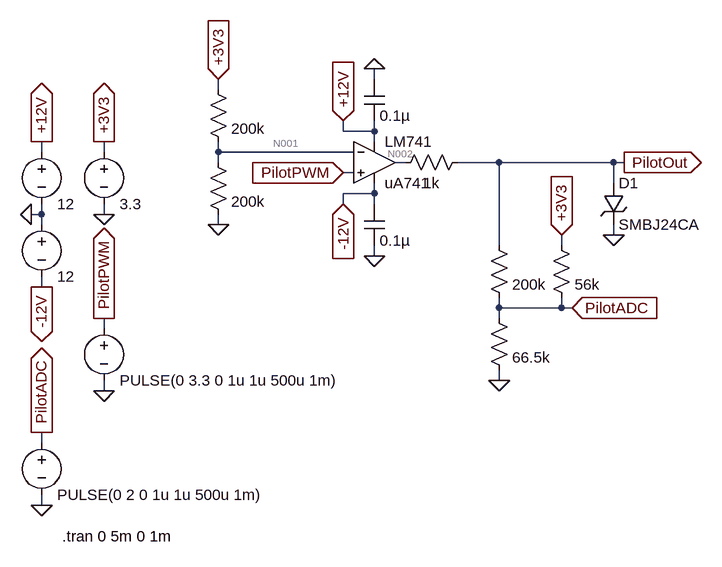
[diagram p0: schematic control_pilot.asc]
* control_pilot.asc
V1 +12V 0 12
V2 0 -12V 12
V3 +3V3 0 3.3
V4 PilotPWM 0 PULSE(0 3.3 0 1u 1u 500u 1m)
R1 +3V3 N001 200k
R2 N001 0 200k
C1 0 +12V 0.1µ V=25
C2 -12V 0 0.1µ V=25
R3 PilotOut N002 1k
R4 +3V3 PilotADC 56k
R5 PilotOut PilotADC 200k
R7 PilotADC 0 66.5k
D1 PilotOut 0 SMBJ24CA
V5 PilotADC 0 PULSE(0 2 0 1u 1u 500u 1m)
* LM741: uA741 (symbol AutoGenerated\uA741 not available, pins judged from their places): In+=PilotPWM In-=N001 V+=+12V V-=-12V OUT=N002
.model D D
.lib standard.dio
.tran 0 5m 0 1m
.backanno
.end

* Results of the author's LTspice run, read from the files saved beside the schematic
* Operating Point, zero values left out:
*   V(+12v) = 12 V
*   V(-12v) = -12 V
*   V(+3v3) = 3.3 V
*   V(n001) = 1.634 V
*   V(pilotout) = -11.76 V
*   V(n002) = -11.82 V
*   I(D1) = -235.1 nA
*   I(R1) = 8.33 µA
*   I(R2) = 8.17 µA
*   I(R3) = 59.02 µA
*   I(R4) = 58.93 µA
*   I(R5) = -58.79 µA
*   I(V1) = -1.337 mA
*   I(V2) = 39.21 mA
*   I(V3) = -67.26 µA
*   I(V4) = 12.99 pA
*   I(V5) = 142.4 nA
*   Ix(lm741:1) = -12.99 pA
*   Ix(lm741:2) = 160.8 nA
*   Ix(lm741:3) = 1.337 mA
*   Ix(lm741:4) = 39.21 mA
*   Ix(lm741:5) = 59.02 µA
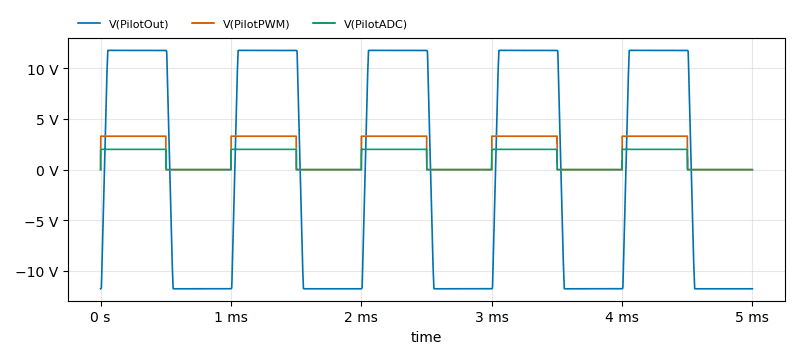
[diagram p1: Transient Analysis of control_pilot.asc, plotted from the saved traces]
* Transient Analysis, 1 run:
*   V(PilotOut): min -11.76 V, max 11.77 V, average 33.08 mV, rms 11.46 V, last -11.76 V
*   V(PilotPWM): min 0 V, max 3.3 V, average 1.653 V, rms 2.335 V, last 0 V
*   V(PilotADC): min 0 V, max 2 V, average 1.002 V, rms 1.415 V, last 0 V